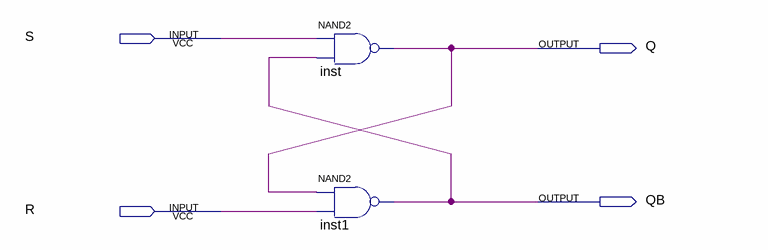
[diagram p0: schematic sheet]
// Quartus schematic rs.bdf as structural Verilog: 2 symbols, 4 pins
module rs (
  input  S,
  input  R,
  output Q,
  output QB
);

  nand inst (Q, S, QB);
  nand inst1 (QB, Q, R);
endmodule
